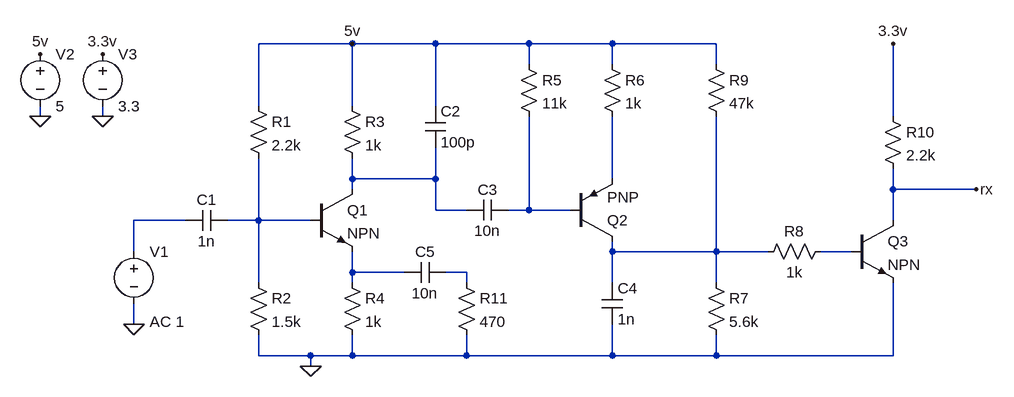
[diagram p0: schematic ook_receiver.asc]
ook_receiver.asc, the LTspice schematic file:
Version 4
SHEET 1 1336 680
WIRE 336 -208 192 -208
WIRE 464 -208 336 -208
WIRE 608 -208 464 -208
WIRE 736 -208 608 -208
WIRE 896 -208 736 -208
WIRE 608 -176 608 -208
WIRE 736 -176 736 -208
WIRE 896 -176 896 -208
WIRE 192 -112 192 -208
WIRE 336 -112 336 -208
WIRE 464 -112 464 -208
WIRE -144 -96 -144 -112
WIRE -48 -96 -48 -112
WIRE 1168 -96 1168 -208
WIRE 336 0 336 -32
WIRE 464 0 464 -48
WIRE 464 0 336 0
WIRE 736 0 736 -96
WIRE 336 16 336 0
WIRE 1168 16 1168 -16
WIRE 1296 16 1168 16
WIRE 464 48 464 0
WIRE 512 48 464 48
WIRE 608 48 608 -96
WIRE 608 48 576 48
WIRE 672 48 608 48
WIRE 80 64 0 64
WIRE 192 64 192 -32
WIRE 192 64 144 64
WIRE 272 64 192 64
WIRE 1168 64 1168 16
WIRE 0 112 0 64
WIRE 736 112 736 96
WIRE 896 112 896 -96
WIRE 896 112 736 112
WIRE 976 112 896 112
WIRE 1104 112 1056 112
WIRE 336 144 336 112
WIRE 416 144 336 144
WIRE 512 144 480 144
WIRE 192 160 192 64
WIRE 336 160 336 144
WIRE 512 160 512 144
WIRE 736 160 736 112
WIRE 896 160 896 112
WIRE 0 224 0 192
WIRE 192 272 192 240
WIRE 272 272 192 272
WIRE 336 272 336 240
WIRE 336 272 272 272
WIRE 512 272 512 240
WIRE 512 272 336 272
WIRE 736 272 736 224
WIRE 736 272 512 272
WIRE 896 272 896 240
WIRE 896 272 736 272
WIRE 1168 272 1168 160
WIRE 1168 272 896 272
WIRE 272 288 272 272
FLAG 272 288 0
FLAG 0 224 0
FLAG 1168 -208 3.3v
FLAG 336 -208 5v
FLAG -144 -96 0
FLAG -48 -96 0
FLAG -48 -192 3.3v
FLAG -144 -192 5v
FLAG 1296 16 rx
SYMBOL voltage 0 96 R0
WINDOW 123 24 124 Left 2
WINDOW 39 0 0 Left 0
SYMATTR InstName V1
SYMATTR Value ""
SYMATTR Value2 AC 1
SYMBOL npn 272 16 R0
SYMATTR InstName Q1
SYMBOL pnp 672 96 M180
SYMATTR InstName Q2
SYMBOL npn 1104 64 R0
SYMATTR InstName Q3
SYMBOL cap 144 48 R90
WINDOW 0 0 32 VBottom 2
WINDOW 3 32 32 VTop 2
SYMATTR InstName C1
SYMATTR Value 1n
SYMBOL res 176 -128 R0
SYMATTR InstName R1
SYMATTR Value 2.2k
SYMBOL res 176 144 R0
SYMATTR InstName R2
SYMATTR Value 1.5k
SYMBOL res 320 -128 R0
SYMATTR InstName R3
SYMATTR Value 1k
SYMBOL res 320 144 R0
SYMATTR InstName R4
SYMATTR Value 1k
SYMBOL cap 448 -112 R0
SYMATTR InstName C2
SYMATTR Value 100p
SYMBOL cap 576 32 R90
WINDOW 0 0 32 VBottom 2
WINDOW 3 32 32 VTop 2
SYMATTR InstName C3
SYMATTR Value 10n
SYMBOL res 592 -192 R0
SYMATTR InstName R5
SYMATTR Value 11k
SYMBOL res 720 -192 R0
SYMATTR InstName R6
SYMATTR Value 1k
SYMBOL cap 720 160 R0
SYMATTR InstName C4
SYMATTR Value 1n
SYMBOL res 880 144 R0
SYMATTR InstName R7
SYMATTR Value 5.6k
SYMBOL res 1072 96 R90
WINDOW 0 0 56 VBottom 2
WINDOW 3 32 56 VTop 2
SYMATTR InstName R8
SYMATTR Value 1k
SYMBOL res 880 -192 R0
SYMATTR InstName R9
SYMATTR Value 47k
SYMBOL res 1152 -112 R0
SYMATTR InstName R10
SYMATTR Value 2.2k
SYMBOL cap 480 128 R90
WINDOW 0 0 32 VBottom 2
WINDOW 3 32 32 VTop 2
SYMATTR InstName C5
SYMATTR Value 10n
SYMBOL res 496 144 R0
SYMATTR InstName R11
SYMATTR Value 470
SYMBOL voltage -144 -208 R0
WINDOW 123 0 0 Left 0
WINDOW 39 0 0 Left 0
SYMATTR InstName V2
SYMATTR Value 5
SYMBOL voltage -48 -208 R0
WINDOW 123 0 0 Left 0
WINDOW 39 0 0 Left 0
SYMATTR InstName V3
SYMATTR Value 3.3

The netlist it stands for:
* ook_receiver.asc
V1 N004 0 AC 1
Q1 N001 N005 N008 0 NPN
Q2 N006 N003 N002 0 PNP
Q3 rx N007 0 0 NPN
C1 N005 N004 1n
R1 5v N005 2.2k
R2 N005 0 1.5k
R3 5v N001 1k
R4 N008 0 1k
C2 5v N001 100p
C3 N003 N001 10n
R5 5v N003 11k
R6 5v N002 1k
C4 N006 0 1n
R7 N006 0 5.6k
R8 N007 N006 1k
R9 5v N006 47k
R10 3.3v rx 2.2k
C5 N009 N008 10n
R11 N009 0 470
V2 5v 0 5
V3 3.3v 0 3.3
.model NPN NPN
.model PNP PNP
.lib standard.bjt
.backanno
.end